# Altium schematic sheet TNY275_V0.SchDoc
size A3
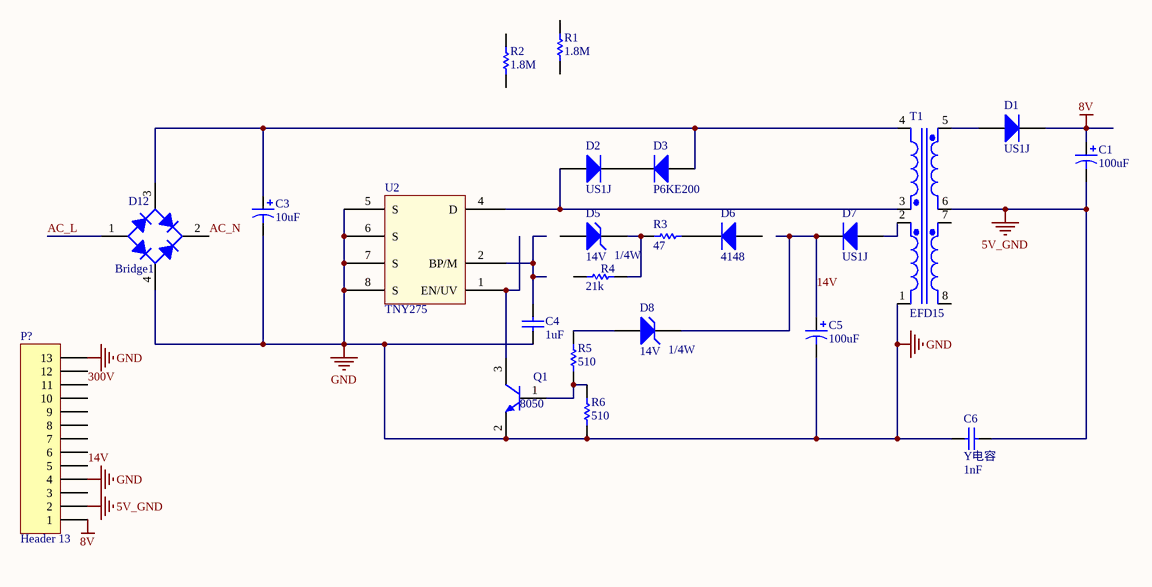
[diagram p0: TNY275_V0.SchDoc]

## Parts
C1  value 100uF  [C-5*7]  (hidden comment: Cap Pol1)
C3  value 10uF  [C-10 卧式]  (hidden comment: Cap Pol1)
C4  value 1uF  [0805]  (hidden comment: Cap)
C5  value 100uF  [电解电容6*11mm-脚距2.5mm]  (hidden comment: Cap Pol1)
C6  Y电容  value 1nF  [07D471K]
D1  US1J  [SMA]
D2  US1J  [SMA]
D3  P6KE200  [SMBJ]
D5  14V  a: 1/4W  [1206]
D6  4148  [1206]
D7  US1J  [SMA]
D8  14V  a: 1/4W  [1206]
D12  Bridge1  [MB10S]
P?  Header 13  [2.54引脚]
Q1  8050  [sot-23]
R1  value 1.8M  [1206]  (hidden comment: Res1)
R2  value 1.8M  [1206]  (hidden comment: Res1)
R3  value 47  [0805]  (hidden comment: Res1)
R4  value 21k  [0805]  (hidden comment: Res1)
R5  value 510  [0805]  (hidden comment: Res1)
R6  value 510  [0805]  (hidden comment: Res1)
T1  EFD15  [EFD15_DIP8]
U2  TNY275  [TNY275_SMD]

## Nets
5V_GND: C1.2 C6.2 P?.2 T1.6(Sec1-)
8V: C1.1 D1.2(K) P?.1
GND: C3.2 C4.1 C5.2 C6.1 D12.4(-) P?.4 P?.13 Q1.2(E) R6.2 T1.1(Pri2-) U2.5(S) U2.6(S) U2.7(S) U2.8(S)
14V: C5.1 D7.2(K) D8.2(K) P?.5
300V: P?.11
AC_L: D12.1(AC)
AC_N: D12.2(AC)
NetC3_1: C3.1 D3.1(A) D12.3(+) T1.4(Pri1+)
NetC4_2: C4.2 U2.2(BP/M)
NetD1_1: D1.1(A) T1.5(Sec1+)
NetD2_1: D2.1(A) T1.3(Pri1-) U2.4(D)
NetD2_2: D2.2(K) D3.2(K)
NetD5_2: D5.2(K) R3.1 R4.1
NetD6_2: D6.2(K) R3.2
NetD7_1: D7.1(A) T1.2(Pri2+)
NetD8_1: D8.1(A) R5.1
NetQ1_1: Q1.1(B) R5.2 R6.1
NetQ1_3: Q1.3(C) U2.1(EN/UV)

Not connected (* = marked no-connect by the designer): D5 1(A); D6 1(A); P? 3 6 7 8 9 10 12; R1 1 2; R2 1 2; R4 2; T1 7(Sec2+) 8(Sec2-)

## Library data of the parts
C1 C3 C5 = Cap Pol1: Polarized Capacitor (Radial); Published: 8-Jun-2000; LatestRevisionDate: 17-Jul-2002; LatestRevisionNote: Re-released for DXP Platform.; PackageReference: RB7.6-15; Publisher: Altium Limited
C4 C6 = Cap: Capacitor; Published: 8-Jun-2000; LatestRevisionDate: 17-Jul-2002; LatestRevisionNote: Re-released for DXP Platform.; PackageReference: RAD-0.3; Publisher: Altium Limited
D1 D6 D7 = Diode 1N4007: 1 Amp General Purpose Rectifier; Published: 8-Jun-2000; LatestRevisionDate: 17-Jul-2002; LatestRevisionNote: Re-released for DXP Platform.; DatasheetVersion: 1998; PackageVersion: Aug-1999; PackageReference: DO-41; Publisher: Altium Limited; Code_JEDEC: DO-204-AL; ComponentLink1Description: Manufacturer Link; ComponentLink1URL: http://www.fairchildsemi.com/; ComponentLink2Description: Datasheet; ComponentLink2URL: http://www.fairchildsemi.com/ds/1N%2F1N4001.pdf
D2 D3 = Diode: Default Diode; Published: 8-Jun-2000; LatestRevisionDate: 17-Jul-2002; LatestRevisionNote: Re-released for DXP Platform.; PackageVersion: Sep-1996; PackageReference: SMC; Publisher: Altium Limited; Code_JEDEC: DO-214-AB
D5 D8 = D Zener: Zener Diode; Published: 8-Jun-2000; LatestRevisionDate: 17-Jul-2002; LatestRevisionNote: Re-released for DXP Platform.; PackageReference: DIODE-0.7; Publisher: Altium Limited
D12 = Bridge1: Full Wave Diode Bridge; Published: 8-Jun-2000; LatestRevisionDate: 17-Jul-2002; LatestRevisionNote: Re-released for DXP Platform.; PackageReference: D-38; Publisher: Altium Limited
P? = Header 13: Header, 13-Pin; LatestRevisionDate: 17-Jul-2002; LatestRevisionNote: Re-released for DXP Platform.; Publisher: Altium Limited
Q1 = NPN: NPN Bipolar Transistor; Published: 8-Jun-2000; LatestRevisionDate: 17-Jul-2002; LatestRevisionNote: Re-released for DXP Platform.; PackageReference: TO-226; Publisher: Altium Limited; Code_JEDEC: TO-226-AA
R1-R6 = Res1: Resistor; Published: 8-Jun-2000; LatestRevisionDate: 17-Jul-2002; LatestRevisionNote: Re-released for DXP Platform.; PackageReference: AXIAL-0.3; Publisher: Altium Limited